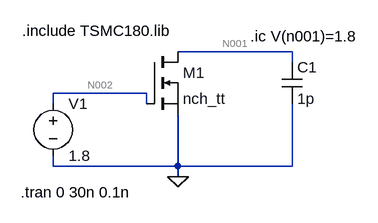
[diagram p0: schematic Prob_1trial.asc]
Prob_1trial.asc, the LTspice schematic file:
Version 4
SHEET 1 880 680
WIRE 432 80 256 80
WIRE 432 96 432 80
WIRE 208 144 64 144
WIRE 64 160 64 144
WIRE 208 160 208 144
WIRE 64 256 64 240
WIRE 256 256 256 176
WIRE 256 256 64 256
WIRE 432 256 432 160
WIRE 432 256 256 256
WIRE 256 272 256 256
FLAG 256 272 0
SYMBOL voltage 64 144 R0
WINDOW 123 0 0 Left 0
WINDOW 39 0 0 Left 0
SYMATTR InstName V1
SYMATTR Value 1.8
SYMBOL cap 416 96 R0
SYMATTR InstName C1
SYMATTR Value 1p
SYMBOL nmos 208 80 R0
SYMATTR InstName M1
SYMATTR Value nch_tt
SYMATTR Value2 w=6u L=10u
TEXT 16 48 Left 2 !.include TSMC180.lib
TEXT 14 296 Left 2 !.tran 0 30n 0.1n
TEXT 368 56 Left 2 !.ic V(n001)=1.8

The netlist it stands for:
* Prob_1trial.asc
V1 N002 0 1.8
C1 N001 0 1p
M1 N001 N002 0 0 nch_tt w=6u L=10u
.model NMOS NMOS
.model PMOS PMOS
.lib standard.mos
.include TSMC180.lib
.tran 0 30n 0.1n
.ic V(n001)=1.8
.backanno
.end

* Results of the author's LTspice run, read from the files saved beside the schematic
* Operating Point, zero values left out:
*   V(n002) = 1.8 V
*   V(n001) = 1.8 V
*   Id(M1) = 122.2 µA
*   Ib(M1) = -1.81 pA
*   Is(M1) = -122.2 µA
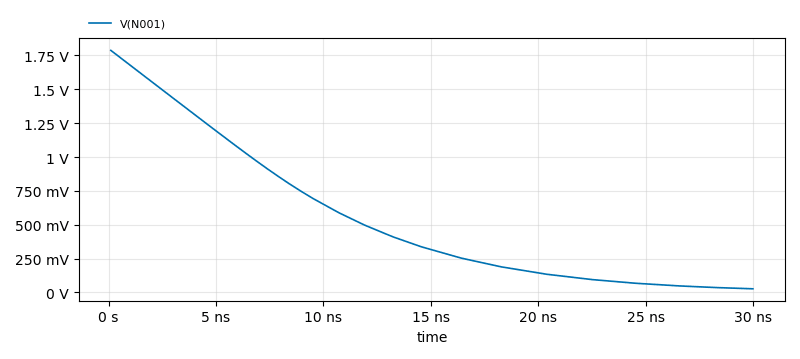
[diagram p1: Transient Analysis of Prob_1trial.asc, plotted from the saved traces]
* Transient Analysis, 1 run:
*   V(N001): min 27.28 mV, max 1.788 V, average 534.9 mV, rms 748.7 mV, last 27.28 mV